# EAGLE schematic MTX18BR (EAGLE 6.1)
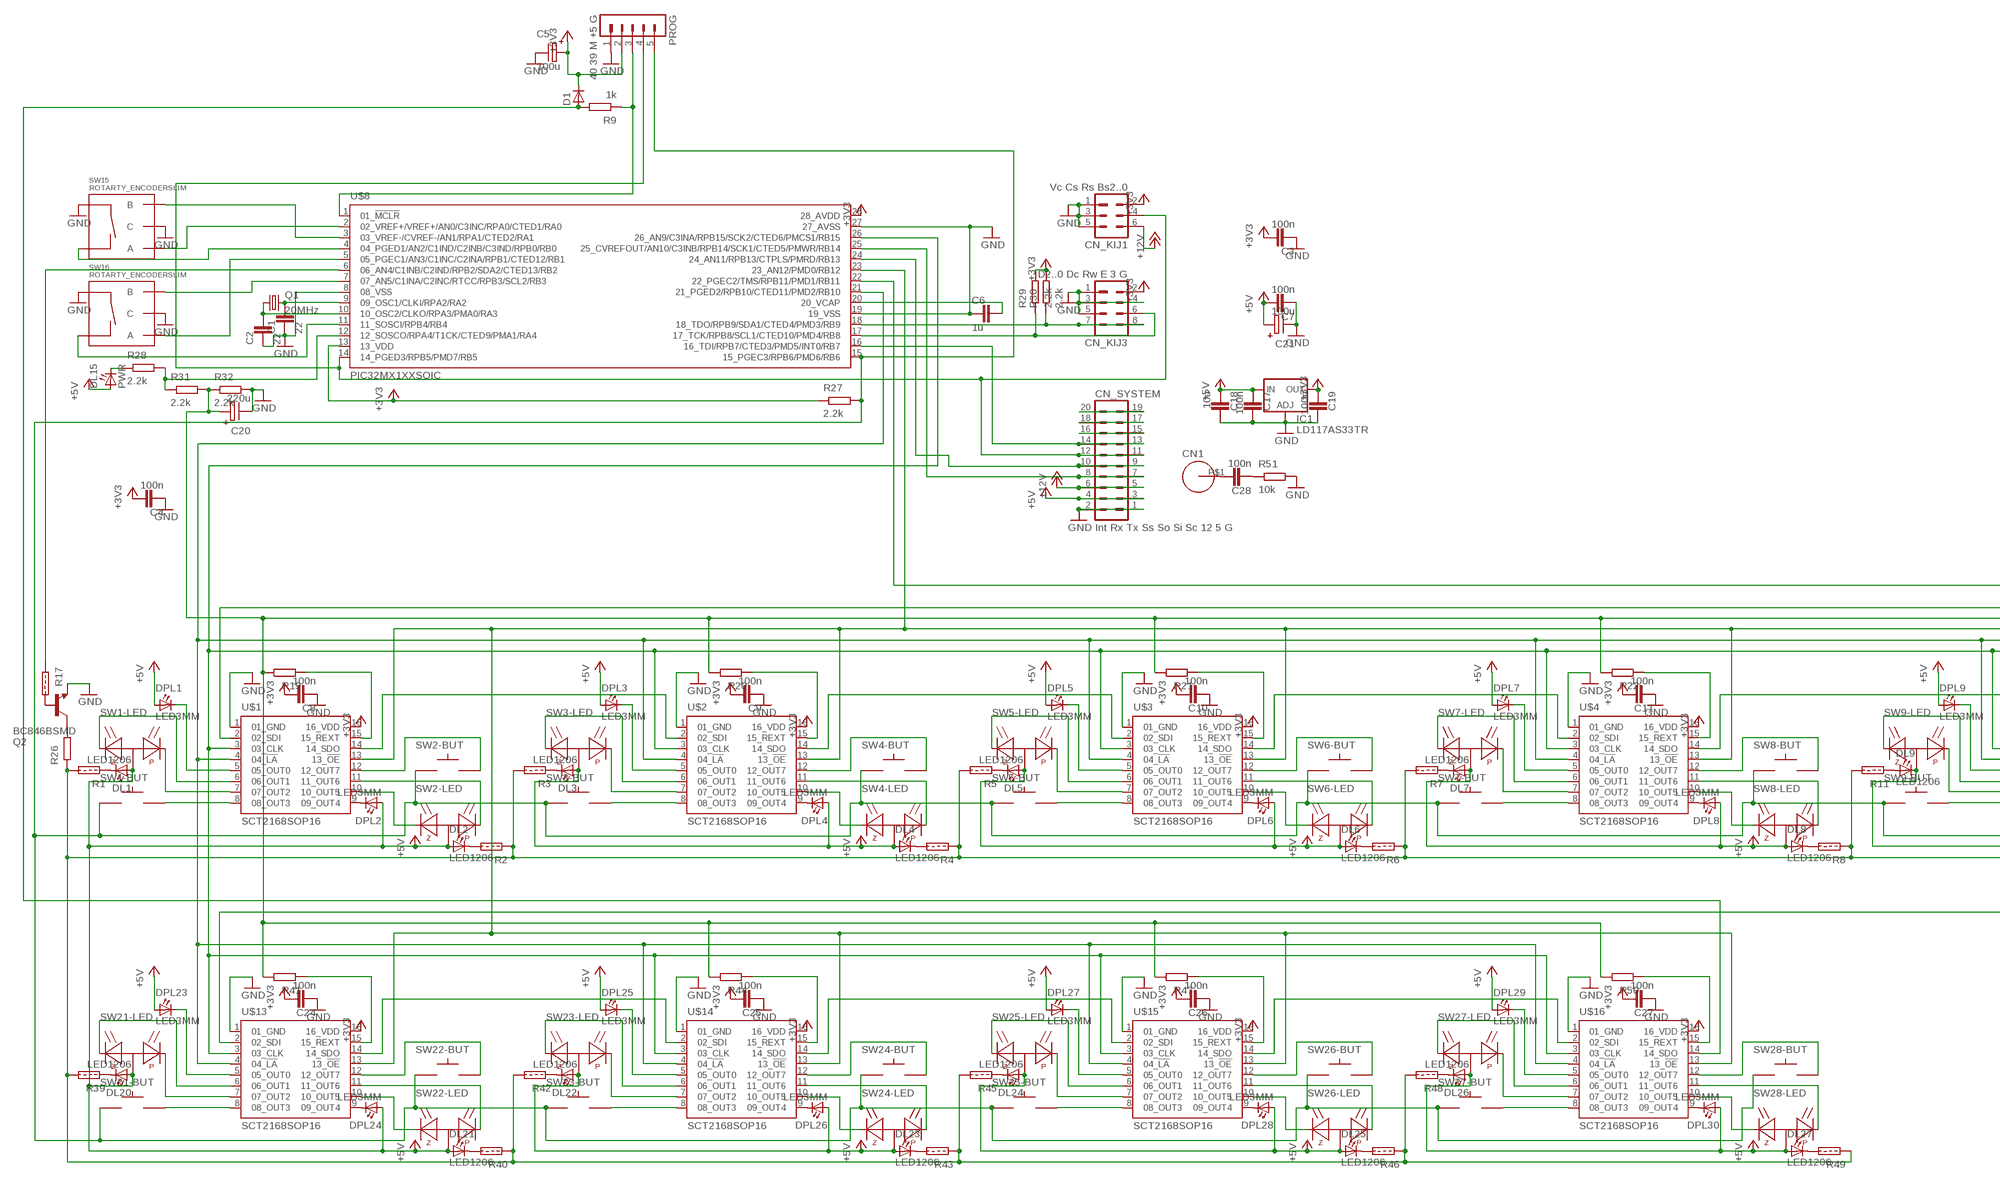
[diagram p0: schematic, sheet 1, part 1 of 3]
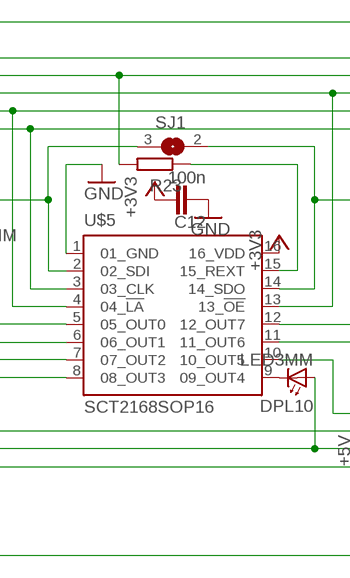
[diagram p1: schematic, sheet 1, part 2 of 3]
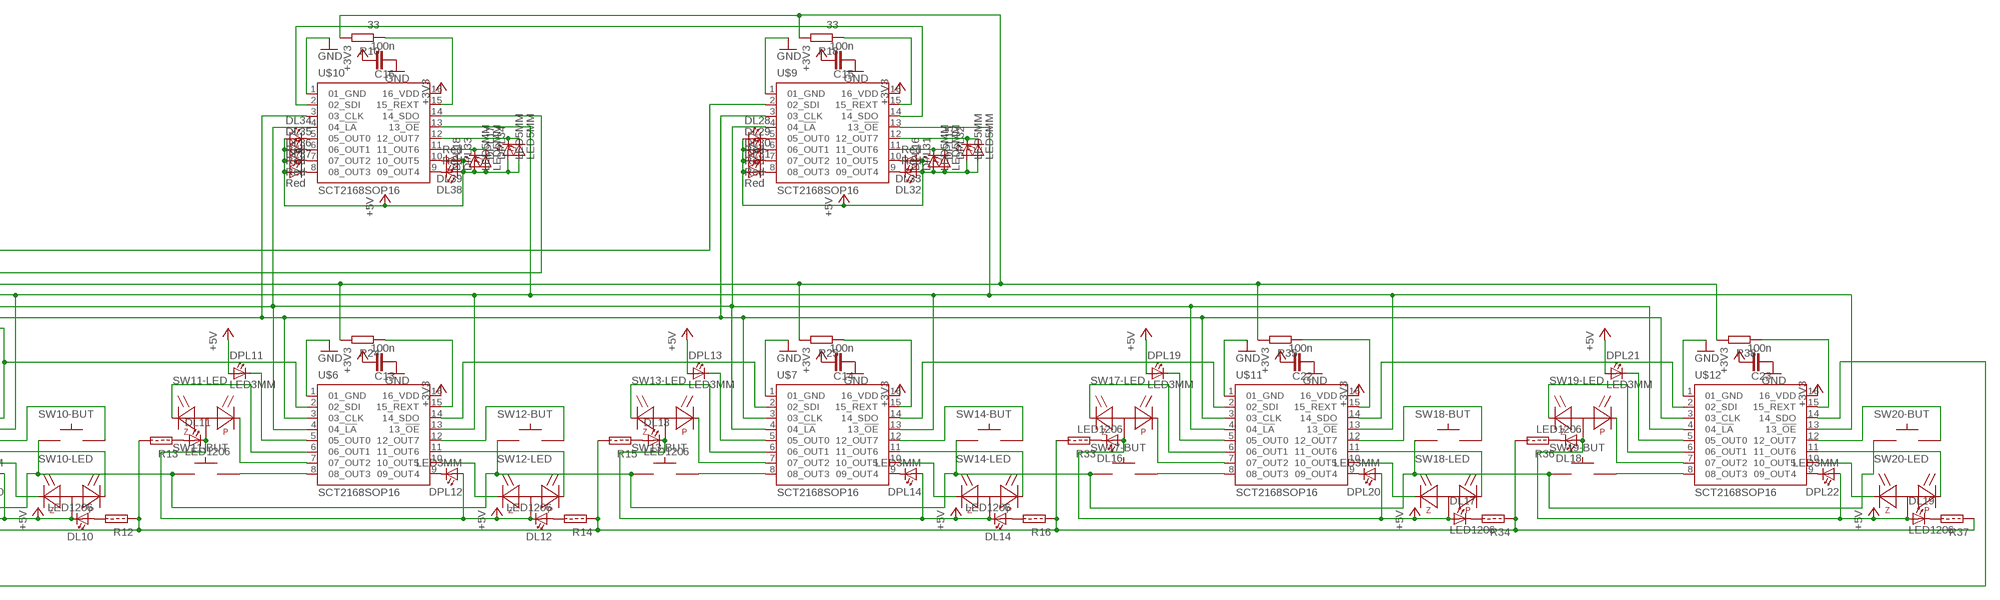
[diagram p2: schematic, sheet 1, part 3 of 3]

## Parts
C1  22  C0805  [R0805]
C2  22  C0805  [R0805]
C3  100n  C0805  [R0805]
C4  100n  C0805  [R0805]
C5  100u  C_EL1R07  [C_EL1RASZT07]
C6  1u  C0805  [R0805]
C7  100n  C0805  [R0805]
C8  100n  C0805  [R0805]
C9  100n  C0805  [R0805]
C10  100n  C0805  [R0805]
C11  100n  C0805  [R0805]
C12  100n  C0805  [R0805]
C13  100n  C0805  [R0805]
C14  100n  C0805  [R0805]
C15  100n  C0805  [R0805]
C16  100n  C0805  [R0805]
C17  100n  C0805  [R0805]
C18  10u  C0805  [R0805]
C19  100n  C0805  [R0805]
C20  220u  C_EL1R07  [C_EL1RASZT07]
C21  100u  C_EL1R07  [C_EL1RASZT07]
C22  100n  C0805  [R0805]
C23  100n  C0805  [R0805]
C24  100n  C0805  [R0805]
C25  100n  C0805  [R0805]
C26  100n  C0805  [R0805]
C27  100n  C0805  [R0805]
C28  100n  C0805  [R0805]
CN1  TESTCSAVAR  [TESTCSAVAR]
CN_KIJ1  Vc Cs Rs Bs2..0  PIN03_2'THT'  [PIN03_2]
CN_KIJ3  D2..0 Dc Rw E 3 G  PIN04_2'THT'  [PIN04_2]
CN_SYSTEM  Int Rx Tx Ss So Si Sc 12 5 G  PIN10_2  [PIN10_2]
D1  DSOD323-R  [SOD323-R]
DL1  LED1206  [R1206]
DL2  LED1206  [R1206]
DL3  LED1206  [R1206]
DL4  LED1206  [R1206]
DL5  LED1206  [R1206]
DL6  LED1206  [R1206]
DL7  LED1206  [R1206]
DL8  LED1206  [R1206]
DL9  LED1206  [R1206]
DL10  LED1206  [R1206]
DL11  LED1206  [R1206]
DL12  LED1206  [R1206]
DL13  LED1206  [R1206]
DL14  LED1206  [R1206]
DL15  PWR  LED5MM  [LED5MM]
DL16  LED1206  [R1206]
DL17  LED1206  [R1206]
DL18  LED1206  [R1206]
DL19  LED1206  [R1206]
DL20  LED1206  [R1206]
DL21  LED1206  [R1206]
DL22  LED1206  [R1206]
DL23  LED1206  [R1206]
DL24  LED1206  [R1206]
DL25  LED1206  [R1206]
DL26  LED1206  [R1206]
DL27  LED1206  [R1206]
DL28  Red  LED5MM  [LED5MM]
DL29  Red  LED5MM  [LED5MM]
DL30  Red  LED5MM  [LED5MM]
DL31  Red  LED5MM  [LED5MM]
DL32  Red  LED5MM  [LED5MM]
DL33  Red  LED5MM  [LED5MM]
DL34  Red  LED5MM  [LED5MM]
DL35  Red  LED5MM  [LED5MM]
DL36  Red  LED5MM  [LED5MM]
DL37  Red  LED5MM  [LED5MM]
DL38  Red  LED5MM  [LED5MM]
DL39  Red  LED5MM  [LED5MM]
DPL1  LED3MM  [LED3MM]
DPL2  LED3MM  [LED3MM]
DPL3  LED3MM  [LED3MM]
DPL4  LED3MM  [LED3MM]
DPL5  LED3MM  [LED3MM]
DPL6  LED3MM  [LED3MM]
DPL7  LED3MM  [LED3MM]
DPL8  LED3MM  [LED3MM]
DPL9  LED3MM  [LED3MM]
DPL10  LED3MM  [LED3MM]
DPL11  LED3MM  [LED3MM]
DPL12  LED3MM  [LED3MM]
DPL13  LED3MM  [LED3MM]
DPL14  LED3MM  [LED3MM]
DPL15  LED5MM  [LED5MM]
DPL16  LED5MM  [LED5MM]
DPL17  LED5MM  [LED5MM]
DPL18  LED5MM  [LED5MM]
DPL19  LED3MM  [LED3MM]
DPL20  LED3MM  [LED3MM]
DPL21  LED3MM  [LED3MM]
DPL22  LED3MM  [LED3MM]
DPL23  LED3MM  [LED3MM]
DPL24  LED3MM  [LED3MM]
DPL25  LED3MM  [LED3MM]
DPL26  LED3MM  [LED3MM]
DPL27  LED3MM  [LED3MM]
DPL28  LED3MM  [LED3MM]
DPL29  LED3MM  [LED3MM]
DPL30  LED3MM  [LED3MM]
DPL31  LED5MM  [LED5MM]
DPL32  LED5MM  [LED5MM]
DPL33  LED5MM  [LED5MM]
DPL34  LED5MM  [LED5MM]
IC1  LD117AS33TR  [SOT223]
PROG  40 39 M +5 G  PIN05_1  [PIN05_1]
Q1  20MHz  XTAL_2QS  [XTAL_QS]
Q2  BC846BSMD  [SOT23]
R1  RNULL_EU0805  [R0805_C]
R2  RNULL_EU0805  [R0805_C]
R3  RNULL_EU0805  [R0805_C]
R4  RNULL_EU0805  [R0805_C]
R5  RNULL_EU0805  [R0805_C]
R6  RNULL_EU0805  [R0805_C]
R7  RNULL_EU0805  [R0805_C]
R8  RNULL_EU0805  [R0805_C]
R9  1k  R_EU0805  [R0805]
R10  33  R_EU0805  [R0805]
R11  RNULL_EU0805  [R0805_C]
R12  RNULL_EU0805  [R0805_C]
R13  RNULL_EU0805  [R0805_C]
R14  RNULL_EU0805  [R0805_C]
R15  RNULL_EU0805  [R0805_C]
R16  RNULL_EU0805  [R0805_C]
R17  RNULL_EU0805  [R0805_C]
R18  33  R_EU0805  [R0805]
R19  R_EU0805  [R0805]
R20  R_EU0805  [R0805]
R21  R_EU0805  [R0805]
R22  R_EU0805  [R0805]
R23  R_EU0805  [R0805]
R24  R_EU0805  [R0805]
R25  R_EU0805  [R0805]
R26  R_EU0805  [R0805]
R27  2.2k  R_EU0805  [R0805]
R28  2.2k  R_EU0805  [R0805]
R29  2.2k  R_EU0805  [R0805]
R30  2.2k  R_EU0805  [R0805]
R31  2.2k  R_EU0805  [R0805]
R32  2.2k  R_EU0805  [R0805]
R33  RNULL_EU0805  [R0805_C]
R34  RNULL_EU0805  [R0805_C]
R35  R_EU0805  [R0805]
R36  RNULL_EU0805  [R0805_C]
R37  RNULL_EU0805  [R0805_C]
R38  R_EU0805  [R0805]
R39  RNULL_EU0805  [R0805_C]
R40  RNULL_EU0805  [R0805_C]
R41  R_EU0805  [R0805]
R42  RNULL_EU0805  [R0805_C]
R43  RNULL_EU0805  [R0805_C]
R44  R_EU0805  [R0805]
R45  RNULL_EU0805  [R0805_C]
R46  RNULL_EU0805  [R0805_C]
R47  R_EU0805  [R0805]
R48  RNULL_EU0805  [R0805_C]
R49  RNULL_EU0805  [R0805_C]
R50  R_EU0805  [R0805]
R51  10k  R_EU0805  [R0805]
SJ1  SJ  [SJ]
SW1  SPG2  [SPG2_3LED]
SW2  SPG2  [SPG2_3LED]
SW3  SPG2  [SPG2_3LED]
SW4  SPG2  [SPG2_3LED]
SW5  SPG2  [SPG2_3LED]
SW6  SPG2  [SPG2_3LED]
SW7  SPG2  [SPG2_3LED]
SW8  SPG2  [SPG2_3LED]
SW9  SPG2  [SPG2_3LED]
SW10  SPG2  [SPG2_3LED]
SW11  SPG2  [SPG2_3LED]
SW12  SPG2  [SPG2_3LED]
SW13  SPG2  [SPG2_3LED]
SW14  SPG2  [SPG2_3LED]
SW15  ROTARTY_ENCODERSLIM  [ROTARY_ENC_SLIM]
SW16  ROTARTY_ENCODERSLIM  [ROTARY_ENC_SLIM]
SW17  SPG2  [SPG2_3LED]
SW18  SPG2  [SPG2_3LED]
SW19  SPG2  [SPG2_3LED]
SW20  SPG2  [SPG2_3LED]
SW21  SPG2  [SPG2_3LED]
SW22  SPG2  [SPG2_3LED]
SW23  SPG2  [SPG2_3LED]
SW24  SPG2  [SPG2_3LED]
SW25  SPG2  [SPG2_3LED]
SW26  SPG2  [SPG2_3LED]
SW27  SPG2  [SPG2_3LED]
SW28  SPG2  [SPG2_3LED]
U$1  SCT2168SOP16  [SO16]
U$2  SCT2168SOP16  [SO16]
U$3  SCT2168SOP16  [SO16]
U$4  SCT2168SOP16  [SO16]
U$5  SCT2168SOP16  [SO16]
U$6  SCT2168SOP16  [SO16]
U$7  SCT2168SOP16  [SO16]
U$8  PIC32MX1XXSOIC  [SOIC127P1032X265-28N]
U$9  SCT2168SOP16  [SO16]
U$10  SCT2168SOP16  [SO16]
U$11  SCT2168SOP16  [SO16]
U$12  SCT2168SOP16  [SO16]
U$13  SCT2168SOP16  [SO16]
U$14  SCT2168SOP16  [SO16]
U$15  SCT2168SOP16  [SO16]
U$16  SCT2168SOP16  [SO16]

## Nets
+3V3: C3.1 C4.1 C5.P+ C8.1 C9.1 C10.1 C11.1 C12.1 C13.1 C14.1 C15.1 C16.1 C19.2 C22.1 C23.1 C24.1 C25.1 C26.1 C27.1 CN_KIJ1.2 CN_KIJ3.2 D1.C DL15.A IC1.4(OUT) PROG.2 R27.1(A) R29.2(E) R30.2(E) U$1.16(16_VDD) U$2.16(16_VDD) U$3.16(16_VDD) U$4.16(16_VDD) U$5.16(16_VDD) U$6.16(16_VDD) U$7.16(16_VDD) U$8.13(13_VDD) U$8.28(28_AVDD) U$9.16(16_VDD) U$10.16(16_VDD) U$11.16(16_VDD) U$12.16(16_VDD) U$13.16(16_VDD) U$14.16(16_VDD) U$15.16(16_VDD) U$16.16(16_VDD) ; supply symbol labelled +5V
+5V: C7.1 C17.2 C18.2 C21.P+ CN_SYSTEM.3 CN_SYSTEM.4 DL1.1(A) DL2.1(A) DL3.1(A) DL4.1(A) DL5.1(A) DL6.1(A) DL7.1(A) DL8.1(A) DL9.2(C) DL10.2(C) DL11.2(C) DL12.2(C) DL13.2(C) DL14.2(C) DL16.1(A) DL17.1(A) DL18.1(A) DL19.1(A) DL20.1(A) DL21.1(A) DL22.1(A) DL23.1(A) DL24.1(A) DL25.1(A) DL26.1(A) DL27.1(A) DL28.A DL29.A DL30.A DL31.A DL32.A DL33.A DL34.A DL35.A DL36.A DL37.A DL38.A DL39.A DPL1.A DPL2.A DPL3.A DPL4.A DPL5.A DPL6.A DPL7.A DPL8.A DPL9.A DPL10.A DPL11.A DPL12.A DPL13.A DPL14.A DPL15.A DPL16.A DPL17.A DPL18.A DPL19.A DPL20.A DPL21.A DPL22.A DPL23.A DPL24.A DPL25.A DPL26.A DPL27.A DPL28.A DPL29.A DPL30.A DPL31.A DPL32.A DPL33.A DPL34.A IC1.3(IN) SW1.LED+(-LED:+) SW2.LED+(-LED:+) SW3.LED+(-LED:+) SW4.LED+(-LED:+) SW5.LED+(-LED:+) SW6.LED+(-LED:+) SW7.LED+(-LED:+) SW8.LED+(-LED:+) SW9.LED+(-LED:+) SW10.LED+(-LED:+) SW11.LED+(-LED:+) SW12.LED+(-LED:+) SW13.LED+(-LED:+) SW14.LED+(-LED:+) SW17.LED+(-LED:+) SW18.LED+(-LED:+) SW19.LED+(-LED:+) SW20.LED+(-LED:+) SW21.LED+(-LED:+) SW22.LED+(-LED:+) SW23.LED+(-LED:+) SW24.LED+(-LED:+) SW25.LED+(-LED:+) SW26.LED+(-LED:+) SW27.LED+(-LED:+) SW28.LED+(-LED:+)
+12V: CN_KIJ1.6 CN_SYSTEM.5 CN_SYSTEM.6
GND [Tap]: C1.2 C2.2 C3.2 C4.2 C5.P- C6.2 C7.2 C8.2 C9.2 C10.2 C11.2 C12.2 C13.2 C14.2 C15.2 C16.2 C17.1 C18.1 C19.1 C20.P- C21.P- C22.2 C23.2 C24.2 C25.2 C26.2 C27.2 CN_KIJ1.1 CN_KIJ1.3 CN_KIJ1.5 CN_KIJ3.1 CN_KIJ3.3 CN_KIJ3.4 CN_KIJ3.5 CN_SYSTEM.1 CN_SYSTEM.2 IC1.1(ADJ) PROG.1 Q2.2(E) R32.2(E) R51.2(E) SW15.C SW15.SW+ SW16.C SW16.SW+ U$1.1(01_GND) U$2.1(01_GND) U$3.1(01_GND) U$4.1(01_GND) U$5.1(01_GND) U$6.1(01_GND) U$7.1(01_GND) U$8.8(08_VSS) U$8.19(19_VSS) U$8.27(27_AVSS) U$9.1(01_GND) U$10.1(01_GND) U$11.1(01_GND) U$12.1(01_GND) U$13.1(01_GND) U$14.1(01_GND) U$15.1(01_GND) U$16.1(01_GND)
N$1: C1.1 Q1.2 U$8.9(09_OSC1/CLKI/RPA2/RA2)
N$2: C2.1 Q1.1 U$8.10(10_OSC2/CLKO/RPA3/PMA0/RA3)
N$3: DL28.K(C) U$9.5(05_OUT0)
N$4: SW5.G2(-BUT:G2) U$3.8(08_OUT3)
N$5: DL29.K(C) U$9.6(06_OUT1)
N$6: DL34.K(C) U$10.5(05_OUT0)
N$7: SW5.P-(-LED:P) U$3.7(07_OUT2)
N$8: DL35.K(C) U$10.6(06_OUT1)
N$9: Q2.1(B) R17.2(E)
N$10: SW6.Z-(-LED:Z) U$3.10(10_OUT5)
N$11: SW5.Z-(-LED:Z) U$3.6(06_OUT1)
N$12: SW6.P-(-LED:P) U$3.11(11_OUT6)
N$13: SW15.B U$8.3(03_VREF-/CVREF-/AN1/RPA1/CTED2/RA1)
N$14: SW6.G2(-BUT:G2) U$3.12(12_OUT7)
N$15: DL10.1(A) R12.2(E)
N$16: DL11.1(A) R13.1(A)
N$17: DPL5.K(C) U$3.5(05_OUT0)
N$18: DL6.2(C) R6.2(E)
N$19: DPL6.K(C) U$3.9(09_OUT4)
N$20: DL5.2(C) R5.1(A)
N$21: R18.1(A) U$9.15(15_REXT)
N$22: SW15.A U$8.2(02_VREF+/VREF+/AN0/C3INC/RPA0/CTED1/RA0)
N$23: DL1.2(C) R1.1(A)
N$24: DPL2.K(C) U$1.9(09_OUT4)
N$25: DL2.2(C) R2.2(E)
N$26: R1.2(E) R2.1(A) R3.2(E) R4.1(A) R5.2(E) R6.1(A) R7.2(E) R8.1(A) R11.2(E) R12.1(A) R13.2(E) R14.1(A) R15.2(E) R16.1(A) R26.1(A) R33.2(E) R34.1(A) R36.2(E) R37.1(A) R39.2(E) R40.1(A) R42.2(E) R43.1(A) R45.2(E) R46.1(A) R48.2(E) R49.1(A)
N$27: SW3.P-(-LED:P) U$2.7(07_OUT2)
N$28: SW3.Z-(-LED:Z) U$2.6(06_OUT1)
N$29: SW1.P-(-LED:P) U$1.7(07_OUT2)
N$30: SW1.Z-(-LED:Z) U$1.6(06_OUT1)
N$31: SW2.Z-(-LED:Z) U$1.10(10_OUT5)
N$32: SW2.P-(-LED:P) U$1.11(11_OUT6)
N$33: R17.1(A) U$8.6(06_AN4/C1INB/C2IND/RPB2/SDA2/CTED13/RB2)
N$34: DL15.K(C) R28.1(A)
N$35: CN_KIJ3.7 CN_KIJ3.8 R30.1(A) U$8.18(18_TDO/RPB9/SDA1/CTED4/PMD3/RB9)
N$36: CN_KIJ3.6 R29.1(A) U$8.17(17_TCK/RPB8/SCL1/CTED10/PMD4/RB8)
N$37: R10.1(A) U$10.15(15_REXT)
N$38: DL36.K(C) U$10.7(07_OUT2)
N$39: DL37.K(C) U$10.8(08_OUT3)
N$40: DL38.K(C) U$10.9(09_OUT4)
N$41: PROG.3 R9.1(A) U$8.1(01_!MCLR!)
N$42: CN_SYSTEM.15 CN_SYSTEM.16
N$43: SW2.G2(-BUT:G2) U$1.12(12_OUT7)
N$44: CN_SYSTEM.17 CN_SYSTEM.18
N$45: CN_SYSTEM.19 CN_SYSTEM.20
N$46: DL39.K(C) U$10.10(10_OUT5)
N$47: DL30.K(C) U$9.7(07_OUT2)
N$48: DL31.K(C) U$9.8(08_OUT3)
N$49: DL32.K(C) U$9.9(09_OUT4)
N$50: SW1.G2(-BUT:G2) U$1.8(08_OUT3)
N$51: DL33.K(C) U$9.10(10_OUT5)
N$52: DPL16.K(C) DPL31.K(C) U$9.11(11_OUT6)
N$53: U$8.22(22_PGEC2/TMS/RPB11/PMD1/RB11) U$9.2(02_SDI)
N$54: U$9.14(14_SDO) U$10.2(02_SDI)
N$55: DPL15.K(C) DPL32.K(C) U$9.12(12_OUT7)
N$56: SW16.B U$8.7(07_AN5/C1INA/C2INC/RTCC/RPB3/SCL2/RB3)
N$57: SW16.A U$8.5(05_PGEC1/AN3/C1INC/C2INA/RPB1/CTED12/RB1)
N$58: DPL1.K(C) U$1.5(05_OUT0)
N$59: SW4.Z-(-LED:Z) U$2.10(10_OUT5)
N$60: SW15.SW- U$8.4(04_PGED1/AN2/C1IND/C2INB/C3IND/RPB0/RB0)
N$61: SW16.SW- U$8.11(11_SOSCI/RPB4/RB4)
N$62: C6.1 U$8.20(20_VCAP)
N$63: U$1.14(14_SDO) U$2.2(02_SDI)
N$64: SW4.P-(-LED:P) U$2.11(11_OUT6)
N$65: SW4.G2(-BUT:G2) U$2.12(12_OUT7)
N$66: SW3.G2(-BUT:G2) U$2.8(08_OUT3)
N$67: DPL3.K(C) U$2.5(05_OUT0)
N$68: DPL17.K(C) DPL34.K(C) U$10.12(12_OUT7)
N$69: DPL18.K(C) DPL33.K(C) U$10.11(11_OUT6)
N$70: SW7.P-(-LED:P) U$4.7(07_OUT2)
N$71: Q2.3(C) R26.2(E)
N$72: R28.2(E) R31.1(A) U$8.12(12_SOSCO/RPA4/T1CK/CTED9/PMA1/RA4)
N$73: C20.P+ R10.2(E) R18.2(E) R19.2(E) R20.2(E) R21.2(E) R22.2(E) R23.2(E) R24.2(E) R25.2(E) R31.2(E) R32.1(A) R35.2(E) R38.2(E) R41.2(E) R44.2(E) R47.2(E) R50.2(E)
N$74: SW7.Z-(-LED:Z) U$4.6(06_OUT1)
N$75: SW8.Z-(-LED:Z) U$4.10(10_OUT5)
N$76: SW8.P-(-LED:P) U$4.11(11_OUT6)
N$77: SW8.G2(-BUT:G2) U$4.12(12_OUT7)
N$78: SW7.G2(-BUT:G2) U$4.8(08_OUT3)
N$79: DPL7.K(C) U$4.5(05_OUT0)
N$80: C28.1 CN1.P$1
N$81: U$2.14(14_SDO) U$3.2(02_SDI)
N$82: DPL4.K(C) U$2.9(09_OUT4)
N$83: DL3.2(C) R3.1(A)
N$84: DL4.2(C) R4.2(E)
N$85: R19.1(A) U$1.15(15_REXT)
N$86: SW9.P-(-LED:P) U$5.7(07_OUT2)
N$87: R20.1(A) U$2.15(15_REXT)
N$88: R21.1(A) U$3.15(15_REXT)
N$89: R22.1(A) U$4.15(15_REXT)
N$90: SW9.Z-(-LED:Z) U$5.6(06_OUT1)
N$91: SW10.Z-(-LED:Z) U$5.10(10_OUT5)
N$92: SW10.P-(-LED:P) U$5.11(11_OUT6)
N$93: SW10.G2(-BUT:G2) U$5.12(12_OUT7)
N$94: SW9.G2(-BUT:G2) U$5.8(08_OUT3)
N$95: DPL9.K(C) U$5.5(05_OUT0)
N$96: SW17.P-(-LED:P) U$11.7(07_OUT2)
N$97: U$3.14(14_SDO) U$4.2(02_SDI)
N$98: R23.1(A) U$5.15(15_REXT)
N$99: DPL8.K(C) U$4.9(09_OUT4)
N$100: DL7.2(C) R7.1(A)
N$101: DL8.2(C) R8.2(E)
N$102: D1.A R9.2(E) U$16.14(14_SDO)
N$103: SW17.Z-(-LED:Z) U$11.6(06_OUT1)
N$104: SW18.Z-(-LED:Z) U$11.10(10_OUT5)
N$105: SW18.P-(-LED:P) U$11.11(11_OUT6)
N$106: SW18.G2(-BUT:G2) U$11.12(12_OUT7)
N$107: SW17.G2(-BUT:G2) U$11.8(08_OUT3)
N$108: SW11.P-(-LED:P) U$6.7(07_OUT2)
N$109: SW11.Z-(-LED:Z) U$6.6(06_OUT1)
N$110: SW12.Z-(-LED:Z) U$6.10(10_OUT5)
N$111: SW12.P-(-LED:P) U$6.11(11_OUT6)
N$112: SW12.G2(-BUT:G2) U$6.12(12_OUT7)
N$113: SW11.G2(-BUT:G2) U$6.8(08_OUT3)
N$114: DPL11.K(C) U$6.5(05_OUT0)
N$115: DPL19.K(C) U$11.5(05_OUT0)
N$116: SJ1.3 U$4.14(14_SDO) U$5.2(02_SDI)
N$117: R24.1(A) U$6.15(15_REXT)
N$118: DPL20.K(C) U$11.9(09_OUT4)
N$119: SW13.P-(-LED:P) U$7.7(07_OUT2)
N$120: DL16.2(C) R33.1(A)
N$121: SW13.Z-(-LED:Z) U$7.6(06_OUT1)
N$122: DL17.2(C) R34.2(E)
N$123: R35.1(A) U$11.15(15_REXT)
N$124: SW14.Z-(-LED:Z) U$7.10(10_OUT5)
N$125: SW14.P-(-LED:P) U$7.11(11_OUT6)
N$126: SW14.G2(-BUT:G2) U$7.12(12_OUT7)
N$127: SW13.G2(-BUT:G2) U$7.8(08_OUT3)
N$128: DPL13.K(C) U$7.5(05_OUT0)
N$129: U$11.14(14_SDO) U$12.2(02_SDI)
N$130: C28.2 R51.1(A)
N$131: R25.1(A) U$7.15(15_REXT)
N$132: U$1.13(13_!OE!) U$2.13(13_!OE!) U$3.13(13_!OE!) U$4.13(13_!OE!) U$5.13(13_!OE!) U$6.13(13_!OE!) U$7.13(13_!OE!) U$8.23(23_AN12/PMD0/RB12) U$9.13(13_!OE!) U$10.13(13_!OE!) U$11.13(13_!OE!) U$12.13(13_!OE!) U$13.13(13_!OE!) U$14.13(13_!OE!) U$15.13(13_!OE!) U$16.13(13_!OE!)
N$133: DPL10.K(C) U$5.9(09_OUT4)
N$134: DPL12.K(C) U$6.9(09_OUT4)
N$135: DPL14.K(C) U$7.9(09_OUT4)
N$136: DL9.1(A) R11.1(A)
N$137: DL12.1(A) R14.2(E)
N$138: DL13.1(A) R15.1(A)
N$139: DL14.1(A) R16.2(E)
N$140: U$6.14(14_SDO) U$7.2(02_SDI)
N$141: SW21.P-(-LED:P) U$13.7(07_OUT2)
N$143: SW21.Z-(-LED:Z) U$13.6(06_OUT1)
N$144: SJ1.2 U$5.14(14_SDO) U$6.2(02_SDI)
N$145: SW22.Z-(-LED:Z) U$13.10(10_OUT5)
N$146: SW22.P-(-LED:P) U$13.11(11_OUT6)
N$147: SW22.G2(-BUT:G2) U$13.12(12_OUT7)
N$148: SW21.G2(-BUT:G2) U$13.8(08_OUT3)
N$149: DPL23.K(C) U$13.5(05_OUT0)
N$150: DPL24.K(C) U$13.9(09_OUT4)
N$151: DL20.2(C) R39.1(A)
N$152: DL21.2(C) R40.2(E)
N$153: R41.1(A) U$13.15(15_REXT)
N$154: U$12.14(14_SDO) U$13.2(02_SDI)
N$155: U$13.14(14_SDO) U$14.2(02_SDI)
N$156: SW19.P-(-LED:P) U$12.7(07_OUT2)
N$157: SW19.Z-(-LED:Z) U$12.6(06_OUT1)
N$158: SW20.Z-(-LED:Z) U$12.10(10_OUT5)
N$159: SW23.P-(-LED:P) U$14.7(07_OUT2)
N$160: SW23.Z-(-LED:Z) U$14.6(06_OUT1)
N$161: SW24.Z-(-LED:Z) U$14.10(10_OUT5)
N$162: SW24.P-(-LED:P) U$14.11(11_OUT6)
N$163: SW24.G2(-BUT:G2) U$14.12(12_OUT7)
N$164: SW23.G2(-BUT:G2) U$14.8(08_OUT3)
N$165: DPL25.K(C) U$14.5(05_OUT0)
N$166: DPL26.K(C) U$14.9(09_OUT4)
N$167: DL22.2(C) R42.1(A)
N$168: DL23.2(C) R43.2(E)
N$169: R44.1(A) U$14.15(15_REXT)
N$170: SW20.P-(-LED:P) U$12.11(11_OUT6)
N$171: U$14.14(14_SDO) U$15.2(02_SDI)
N$172: SW20.G2(-BUT:G2) U$12.12(12_OUT7)
N$173: SW19.G2(-BUT:G2) U$12.8(08_OUT3)
N$174: DPL21.K(C) U$12.5(05_OUT0)
N$175: SW25.P-(-LED:P) U$15.7(07_OUT2)
N$176: SW25.Z-(-LED:Z) U$15.6(06_OUT1)
N$177: SW26.Z-(-LED:Z) U$15.10(10_OUT5)
N$178: SW26.P-(-LED:P) U$15.11(11_OUT6)
N$179: SW26.G2(-BUT:G2) U$15.12(12_OUT7)
N$180: SW25.G2(-BUT:G2) U$15.8(08_OUT3)
N$181: DPL27.K(C) U$15.5(05_OUT0)
N$182: DPL28.K(C) U$15.9(09_OUT4)
N$183: DL24.2(C) R45.1(A)
N$184: DL25.2(C) R46.2(E)
N$185: R47.1(A) U$15.15(15_REXT)
N$186: DPL22.K(C) U$12.9(09_OUT4)
N$187: U$15.14(14_SDO) U$16.2(02_SDI)
N$188: DL18.2(C) R36.1(A)
N$189: DL19.2(C) R37.2(E)
N$191: SW27.P-(-LED:P) U$16.7(07_OUT2)
N$192: SW27.Z-(-LED:Z) U$16.6(06_OUT1)
N$193: SW28.Z-(-LED:Z) U$16.10(10_OUT5)
N$194: SW28.P-(-LED:P) U$16.11(11_OUT6)
N$195: SW28.G2(-BUT:G2) U$16.12(12_OUT7)
N$196: SW27.G2(-BUT:G2) U$16.8(08_OUT3)
N$197: DPL29.K(C) U$16.5(05_OUT0)
N$198: DPL30.K(C) U$16.9(09_OUT4)
N$199: DL26.2(C) R48.1(A)
N$200: DL27.2(C) R49.2(E)
N$201: R50.1(A) U$16.15(15_REXT)
N$202: R38.1(A) U$12.15(15_REXT)
N$206: U$7.14(14_SDO) U$11.2(02_SDI)
SCK1: CN_SYSTEM.7 CN_SYSTEM.8 U$8.25(25_CVREFOUT/AN10/C3INB/RPB14/SCK1/CTED5/PMWR/RB14)
SCK3: U$1.3(03_CLK) U$2.3(03_CLK) U$3.3(03_CLK) U$4.3(03_CLK) U$5.3(03_CLK) U$6.3(03_CLK) U$7.3(03_CLK) U$8.26(26_AN9/C3INA/RPB15/SCK2/CTED6/PMCS1/RB15) U$9.3(03_CLK) U$10.3(03_CLK) U$11.3(03_CLK) U$12.3(03_CLK) U$13.3(03_CLK) U$14.3(03_CLK) U$15.3(03_CLK) U$16.3(03_CLK)
SDI1: CN_KIJ1.4 CN_SYSTEM.11 CN_SYSTEM.12 PROG.4 U$8.14(14_PGED3/RPB5/PMD7/RB5)
SDI2: PROG.5 R27.2(E) SW1.G1(-BUT:G1) SW2.G1(-BUT:G1) SW3.G1(-BUT:G1) SW4.G1(-BUT:G1) SW5.G1(-BUT:G1) SW6.G1(-BUT:G1) SW7.G1(-BUT:G1) SW8.G1(-BUT:G1) SW9.G1(-BUT:G1) SW10.G1(-BUT:G1) SW11.G1(-BUT:G1) SW12.G1(-BUT:G1) SW13.G1(-BUT:G1) SW14.G1(-BUT:G1) SW17.G1(-BUT:G1) SW18.G1(-BUT:G1) SW19.G1(-BUT:G1) SW20.G1(-BUT:G1) SW21.G1(-BUT:G1) SW22.G1(-BUT:G1) SW23.G1(-BUT:G1) SW24.G1(-BUT:G1) SW25.G1(-BUT:G1) SW26.G1(-BUT:G1) SW27.G1(-BUT:G1) SW28.G1(-BUT:G1) U$8.15(15_PGEC3/RPB6/PMD6/RB6)
SDO1: CN_SYSTEM.9 CN_SYSTEM.10 U$8.24(24_AN11/RPB13/CTPLS/PMRD/RB13)
SDO2: U$1.2(02_SDI) U$10.14(14_SDO)
SS1: CN_SYSTEM.13 CN_SYSTEM.14 U$8.16(16_TDI/RPB7/CTED3/PMD5/INT0/RB7)
SS3: U$1.4(04_!LA!) U$2.4(04_!LA!) U$3.4(04_!LA!) U$4.4(04_!LA!) U$5.4(04_!LA!) U$6.4(04_!LA!) U$7.4(04_!LA!) U$8.21(21_PGED2/RPB10/CTED11/PMD2/RB10) U$9.4(04_!LA!) U$10.4(04_!LA!) U$11.4(04_!LA!) U$12.4(04_!LA!) U$13.4(04_!LA!) U$14.4(04_!LA!) U$15.4(04_!LA!) U$16.4(04_!LA!)

## Library data of the parts
C1-C4 C6-C19 C22-C28 = Cf_RLCPX:C
C5 C20 C21 = Cf_RLCPX:C_EL
CN1 = Cf_Csatl:TESTCSAVAR
CN_KIJ1 = Cf_Csatl:PIN03_2
CN_KIJ3 = Cf_Csatl:PIN04_2
CN_SYSTEM = Cf_Csatl:PIN10_2
D1 = Cf_Felv:D
DL1-DL39 DPL1-DPL34 = Cf_Felv:LED
IC1 = narval:LD117A?*: Low drop fixed and adjustable positive voltage regulators 1 A Source: http://www.st.com/stonline/products/literature/ds/7194/ld1117axx.pdf
PROG = Cf_Csatl:PIN05_1
Q1 = Cf_RLCPX:XTAL_2
Q2 = narval:BC846*: NPN Transistor
R1-R8 R11-R17 R33 R34 R36 R37 R39 R40 R42 R43 R45 R46 R48 R49 = Cf_RLCPX:RNULL_EU
R9 R10 R18-R32 R35 R38 R41 R44 R47 R50 R51 = Cf_RLCPX:R_EU
SJ1 = jumper:SJ: SMD solder JUMPER
SW1-SW14 SW17-SW28 = narval:SPG2
SW15 SW16 = narval:ROTARTY_ENCODER: Simple no LED rotary encoder Example: COM-09117
U$1-U$7 U$9-U$16 = Cf_IC:SCT2168
U$8 = Narvalex:PIC32MX1XX

## Net classes
0 default: width 0.305 mm, clearance 0.305 mm
1 Tap: width 0.406 mm, clearance 0.305 mm